# Altium schematic sheet DASH_REGULATORS.SchDoc
size A
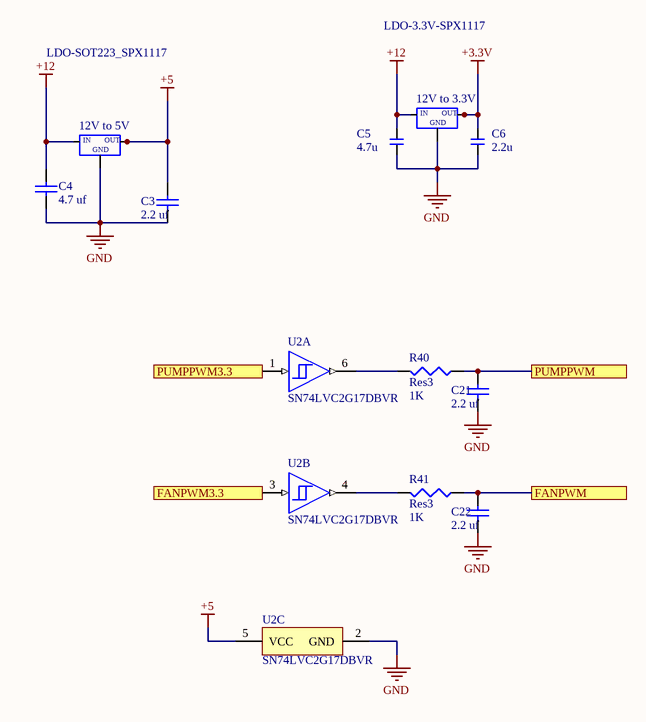
[diagram p0: DASH_REGULATORS.SchDoc]

## Parts
12V_to_3.3V  LDO-3.3V-SPX1117  [SOT223]
12V_to_5V  LDO-SOT223_SPX1117  [SOT223]
C3  2.2 uf  [CAPC1608X87X35NL15T15]
C4  4.7 uf  [CAPC1608X87X35NL15T15]
C5  4.7u  [CAP-0603]
C6  2.2u  [CAP-0603]
C21  2.2 uf  [CAPC1608X87X35NL15T15]
C22  2.2 uf  [CAPC1608X87X35NL15T15]
R40  Res3  value 1K  [J1-0603]
R41  Res3  value 1K  [J1-0603]
U2  SN74LVC2G17DBVR  [DBV0006A_N]  (parts A,B,C of 3)

## Ports
FANPWM, FANPWM3.3, PUMPPWM, PUMPPWM3.3

## Nets
+3.3V: 12V_to_3.3V.2 12V_to_3.3V.4 C6.2
+5: 12V_to_5V.2 12V_to_5V.4 C3.2 U2.5(VCC)
+12: 12V_to_3.3V.3 12V_to_5V.3 C4.2 C5.2
GND: 12V_to_3.3V.1 12V_to_5V.1 C3.1 C4.1 C5.1 C6.1 C21.1 C22.1 U2.2(GND)
FANPWM: C22.2 R41.1 ; port FANPWM
FANPWM3.3: U2.3(2A) ; port FANPWM3.3
PUMPPWM: C21.2 R40.1 ; port PUMPPWM
PUMPPWM3.3: U2.1(1A) ; port PUMPPWM3.3
NetR40_2: R40.2 U2.6(1Y)
NetR41_2: R41.2 U2.4(2Y)

## Notes on the sheet
- (in symbol CMP-015-000050-1) IN; OUT; GND
- (in symbol LDO-SOT223_SPX1117) IN; OUT; GND

## Library data of the parts
12V_to_3.3V = LDO-SOT223_SPX1117
12V_to_5V = CMP-015-000050-1: Design Item ID: LDO-SOT223_SPX1117; Source: ife19_Elec_Library.SchLib
C3 C4 C21 C22 = CMP-2006-03887-1: .1 uf; Part Number: C0603C104J3RAC7867; Manufacturer: Kemet
C5 C6 = CAP-0603
R40 R41 = Res3: Resistor; Published: 8-Jun-2000; LatestRevisionDate: 29-May-2009; LatestRevisionNote: IPC-7351 Footprint Added.; PackageReference: J1-0603; Publisher: Altium Limited; PackageDescription: Chip Resistor
U2 = CMP-0859-00225-4: Dual Schmitt-Trigger Buffer, DBV0006A, LARGE T&R; Manufacturer: Texas Instruments; F @ Nom Voltage(Max)(Mhz): 150; VCC(Max)(V): 5.5; tpd @ Nom Voltage(Max)(ns): 9.3,5.7,5.4,4.3; Sub-Family: Non-Inverting Buffer/Driver; Output Drive (IOL/IOH)(Max)(mA): 32/-32; Output Type: CMOS; Voltage(Nom)(V): 1.8,2.5,3.3,5; ICC @ Nom Voltage(Max)(mA): 0.01; Schmitt Trigger: Yes; Technology Family: LVC; VCC(Min)(V): 1.65; 3-State Output: No; Rating: Catalog; Bits(#): 2; Input Type: CMOS/TTL; Logic: True; DatasheetVersion: SCES381N; Generic Part Number: SN74LVC2G17; PackageReference: DBV0006A; Operating Temperature Range(C): -40 to 125,-40 to 85